# Altium project MCH_MAIN.PrjPcb (part 1 of 3)
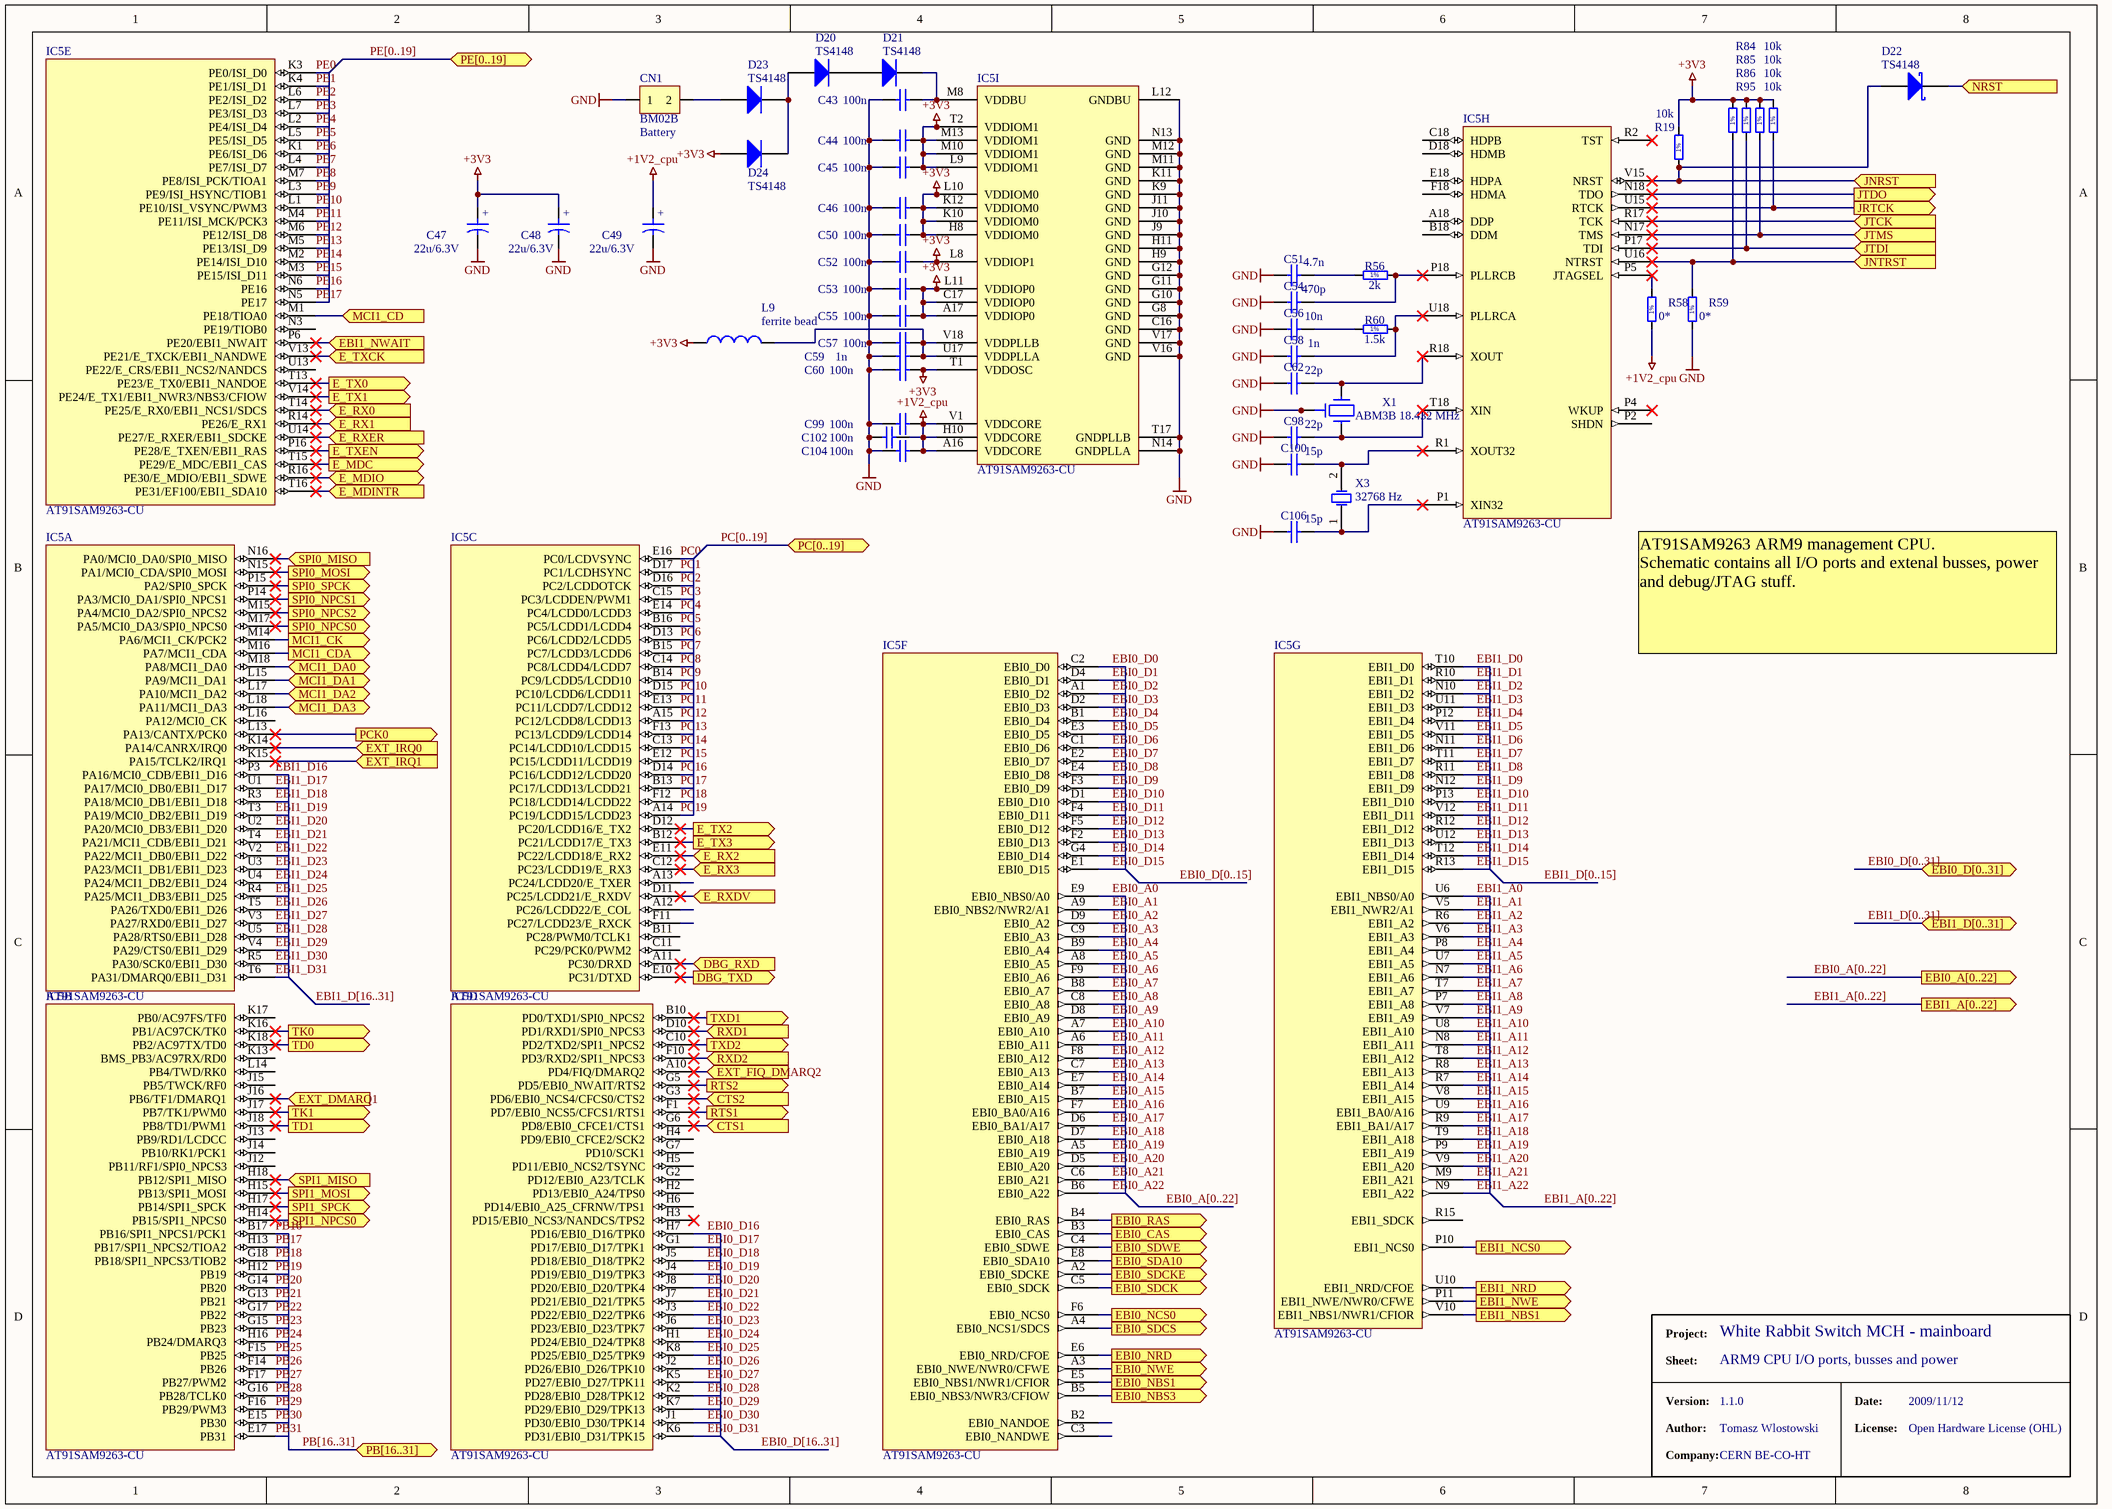
[diagram p0: MB_CPU_io_ports.SchDoc]
5 sheets, 181 parts. Net scope: hierarchical (ports join the sheet entries above them; power ports are global).
Board file: MCH_MAIN.PCBDOC
Sheets:
  MB_CPU_io_ports.SchDoc
  MB_main_FPGA.SchDoc
  MB_ZBT_memory.SchDoc
  MB_fpga_power.SchDoc
  MB_downlink_phy.SchDoc

## Sheet MB_CPU_io_ports.SchDoc
size A3

### Parts
C43  100n  [CAPC1005X55N]
C44  100n  [CAPC1005X55N]
C45  100n  [CAPC1005X55N]
C46  100n  [CAPC1005X55N]
C47  22u/6.3V  [CAPMP3216X180N]
C48  22u/6.3V  [CAPMP3216X180N]
C49  22u/6.3V  [CAPMP3216X180N]
C50  100n  [CAPC1005X55N]
C51  4.7n  [CAPC1005X55N]
C52  100n  [CAPC1005X55N]
C53  100n  [CAPC1005X55N]
C54  470p  [CAPC1005X55N]
C55  100n  [CAPC1005X55N]
C56  10n  [CAPC1005X55N]
C57  100n  [CAPC1005X55N]
C58  1n  [CAPC1005X55N]
C59  1n  [CAPC1005X55N]
C60  100n  [CAPC1005X55N]
C62  22p  [CAPC1005X55N]
C98  22p  [CAPC1005X55N]
C99  100n  [CAPC1005X55N]
C100  15p  [CAPC1005X55N]
C102  100n  [CAPC1005X55N]
C104  100n  [CAPC1005X55N]
C106  15p  [CAPC1005X55N]
CN1  BM02B  Comment2: Battery  [SH_CRIMP_1MM_2]
D20  TS4148  [CD2012-0805]
D21  TS4148  [CD2012-0805]
D22  TS4148  [CD2012-0805]
D23  TS4148  [CD2012-0805]
D24  TS4148  [CD2012-0805]
IC5  AT91SAM9263-CU  [TFBGA324]  (parts A,B,C,D,E,F,G,H,I of 9)
L9  value ferrite bead  [INDC1608-0603]  (hidden comment: fer.bead)
R19  10k  [RESC1005X40N]
R56  2k  [RESC1005X40N]
R58  0*  [RESC1005X40N]
R59  0*  [RESC1005X40N]
R60  1.5k  [RESC1005X40N]
R84  10k  [RESC1005X40N]
R85  10k  [RESC1005X40N]
R86  10k  [RESC1005X40N]
R95  10k  [RESC1005X40N]
X1  ABM3B 18.432 MHz  [XTALL_ABM3]
X3  32768 Hz  [XTAL_32k]

### Ports
CTS1 (in), CTS2 (in), DBG_RXD (in), DBG_TXD (out), E_MDC (out), E_MDINTR (in), E_MDIO (bidir), E_RX0 (in), E_RX1 (in), E_RX2 (in), E_RX3 (in), E_RXDV (in), E_RXER (in), E_TX0 (out), E_TX1 (out), E_TX2 (out), E_TX3 (out), E_TXCK (in), E_TXEN (out), EBI0_A[0..22] (out), EBI0_CAS (out), EBI0_D[0..31] (bidir), EBI0_NBS1 (out), EBI0_NBS3 (out), EBI0_NCS0 (out), EBI0_NRD (out), EBI0_NWE (out), EBI0_RAS (out), EBI0_SDA10 (out), EBI0_SDCK (out), EBI0_SDCKE (out), EBI0_SDCS (out), EBI0_SDWE (out), EBI1_A[0..22] (out), EBI1_D[0..31] (bidir), EBI1_NBS1 (out), EBI1_NCS0 (out), EBI1_NRD (out), EBI1_NWAIT (in), EBI1_NWE (out), EXT_DMARQ1 (in), EXT_FIQ_DMARQ2 (in), EXT_IRQ0 (in), EXT_IRQ1 (in), JNRST (in), JNTRST (in), JRTCK (out), JTCK (in), JTDI (in), JTDO (out), JTMS (in), MCI1_CD (in), MCI1_CDA (out), MCI1_CK (out), MCI1_DA0 (bidir), MCI1_DA1 (bidir), MCI1_DA2 (bidir), MCI1_DA3 (bidir), NRST (in), PB[16..31] (bidir), PC[0..19] (bidir), PCK0 (out), PE[0..19] (bidir), RTS1 (out), RTS2 (out), RXD1 (in), RXD2 (in), SPI0_MISO (in), SPI0_MOSI (out), SPI0_NPCS0 (out), SPI0_NPCS1 (out), SPI0_NPCS2 (out), SPI0_SPCK (out), SPI1_MISO (in), SPI1_MOSI (out), SPI1_NPCS0 (out), SPI1_SPCK (out), TD0 (out), TD1 (out), TK0 (out), TK1 (out), TXD1 (out), TXD2 (out)

### Nets
+1V2_cpu: C49.1 C99.2 C102.2 C104.2 IC5.A16(VDDCORE) IC5.H10(VDDCORE) IC5.V1(VDDCORE) R58.1
+3V3: C44.2 C45.2 C46.2 C47.1 C48.1 C50.2 C52.2 C53.2 C55.2 C60.2 D24.1(A) IC5.A17(VDDIOP0) IC5.C17(VDDIOP0) IC5.H8(VDDIOM0) IC5.K10(VDDIOM0) IC5.K12(VDDIOM0) IC5.L8(VDDIOP1) IC5.L9(VDDIOM1) IC5.L10(VDDIOM0) IC5.L11(VDDIOP0) IC5.M10(VDDIOM1) IC5.M13(VDDIOM1) IC5.T1(VDDOSC) IC5.T2(VDDIOM1) L9.1 R19.2 R84.2 R85.2 R86.2 R95.2
GND: C43.1 C44.1 C45.1 C46.1 C47.2 C48.2 C49.2 C50.1 C51.1 C52.1 C53.1 C54.1 C55.1 C56.1 C57.1 C58.1 C59.1 C60.1 C62.1 C98.1 C99.1 C100.1 C102.1 C104.1 C106.1 CN1.1 IC5.C16(GND) IC5.G8(GND) IC5.G10(GND) IC5.G11(GND) IC5.G12(GND) IC5.H9(GND) IC5.H11(GND) IC5.J9(GND) IC5.J10(GND) IC5.J11(GND) IC5.K9(GND) IC5.K11(GND) IC5.L12(GNDBU) IC5.M11(GND) IC5.M12(GND) IC5.N13(GND) IC5.N14(GNDPLLA) IC5.T17(GNDPLLB) IC5.V16(GND) IC5.V17(GND) R59.1 X1.2 X1.4
EBI0_A0: IC5.E9(EBI0_NBS0/A0)
EBI0_A1: IC5.A9(EBI0_NBS2/NWR2/A1)
EBI0_A2: IC5.D9(EBI0_A2)
EBI0_A3: IC5.C9(EBI0_A3)
EBI0_A4: IC5.B9(EBI0_A4)
EBI0_A5: IC5.A8(EBI0_A5)
EBI0_A6: IC5.F9(EBI0_A6)
EBI0_A7: IC5.B8(EBI0_A7)
EBI0_A8: IC5.C8(EBI0_A8)
EBI0_A9: IC5.D8(EBI0_A9)
EBI0_A10: IC5.A7(EBI0_A10)
EBI0_A11: IC5.A6(EBI0_A11)
EBI0_A12: IC5.F8(EBI0_A12)
EBI0_A13: IC5.C7(EBI0_A13)
EBI0_A14: IC5.E7(EBI0_A14)
EBI0_A15: IC5.B7(EBI0_A15)
EBI0_A16: IC5.F7(EBI0_BA0/A16)
EBI0_A17: IC5.D6(EBI0_BA1/A17)
EBI0_A18: IC5.D7(EBI0_A18)
EBI0_A19: IC5.A5(EBI0_A19)
EBI0_A20: IC5.D5(EBI0_A20)
EBI0_A21: IC5.C6(EBI0_A21)
EBI0_A22: IC5.B6(EBI0_A22)
EBI0_D0: IC5.C2(EBI0_D0)
EBI0_D1: IC5.D4(EBI0_D1)
EBI0_D2: IC5.A1(EBI0_D2)
EBI0_D3: IC5.D2(EBI0_D3)
EBI0_D4: IC5.B1(EBI0_D4)
EBI0_D5: IC5.E3(EBI0_D5)
EBI0_D6: IC5.C1(EBI0_D6)
EBI0_D7: IC5.E2(EBI0_D7)
EBI0_D8: IC5.E4(EBI0_D8)
EBI0_D9: IC5.F3(EBI0_D9)
EBI0_D10: IC5.D1(EBI0_D10)
EBI0_D11: IC5.F4(EBI0_D11)
EBI0_D12: IC5.F5(EBI0_D12)
EBI0_D13: IC5.F2(EBI0_D13)
EBI0_D14: IC5.G4(EBI0_D14)
EBI0_D15: IC5.E1(EBI0_D15)
EBI0_D16: IC5.H7(PD16/EBI0_D16/TPK0)
EBI0_D17: IC5.G1(PD17/EBI0_D17/TPK1)
EBI0_D18: IC5.J5(PD18/EBI0_D18/TPK2)
EBI0_D19: IC5.J4(PD19/EBI0_D19/TPK3)
EBI0_D20: IC5.J8(PD20/EBI0_D20/TPK4)
EBI0_D21: IC5.J7(PD21/EBI0_D21/TPK5)
EBI0_D22: IC5.J3(PD22/EBI0_D22/TPK6)
EBI0_D23: IC5.J6(PD23/EBI0_D23/TPK7)
EBI0_D24: IC5.H1(PD24/EBI0_D24/TPK8)
EBI0_D25: IC5.K8(PD25/EBI0_D25/TPK9)
EBI0_D26: IC5.J2(PD26/EBI0_D26/TPK10)
EBI0_D27: IC5.K5(PD27/EBI0_D27/TPK11)
EBI0_D28: IC5.K2(PD28/EBI0_D28/TPK12)
EBI0_D29: IC5.K7(PD29/EBI0_D29/TPK13)
EBI0_D30: IC5.J1(PD30/EBI0_D30/TPK14)
EBI0_D31: IC5.K6(PD31/EBI0_D31/TPK15)
EBI1_A0: IC5.U6(EBI1_NBS0/A0)
EBI1_A1: IC5.V5(EBI1_NWR2/A1)
EBI1_A2: IC5.R6(EBI1_A2)
EBI1_A3: IC5.V6(EBI1_A3)
EBI1_A4: IC5.P8(EBI1_A4)
EBI1_A5: IC5.U7(EBI1_A5)
EBI1_A6: IC5.N7(EBI1_A6)
EBI1_A7: IC5.T7(EBI1_A7)
EBI1_A8: IC5.P7(EBI1_A8)
EBI1_A9: IC5.V7(EBI1_A9)
EBI1_A10: IC5.U8(EBI1_A10)
EBI1_A11: IC5.N8(EBI1_A11)
EBI1_A12: IC5.T8(EBI1_A12)
EBI1_A13: IC5.R8(EBI1_A13)
EBI1_A14: IC5.R7(EBI1_A14)
EBI1_A15: IC5.V8(EBI1_A15)
EBI1_A16: IC5.U9(EBI1_BA0/A16)
EBI1_A17: IC5.R9(EBI1_BA1/A17)
EBI1_A18: IC5.T9(EBI1_A18)
EBI1_A19: IC5.P9(EBI1_A19)
EBI1_A20: IC5.V9(EBI1_A20)
EBI1_A21: IC5.M9(EBI1_A21)
EBI1_A22: IC5.N9(EBI1_A22)
EBI1_D0: IC5.T10(EBI1_D0)
EBI1_D1: IC5.R10(EBI1_D1)
EBI1_D2: IC5.N10(EBI1_D2)
EBI1_D3: IC5.U11(EBI1_D3)
EBI1_D4: IC5.P12(EBI1_D4)
EBI1_D5: IC5.V11(EBI1_D5)
EBI1_D6: IC5.N11(EBI1_D6)
EBI1_D7: IC5.T11(EBI1_D7)
EBI1_D8: IC5.R11(EBI1_D8)
EBI1_D9: IC5.N12(EBI1_D9)
EBI1_D10: IC5.P13(EBI1_D10)
EBI1_D11: IC5.V12(EBI1_D11)
EBI1_D12: IC5.R12(EBI1_D12)
EBI1_D13: IC5.U12(EBI1_D13)
EBI1_D14: IC5.T12(EBI1_D14)
EBI1_D15: IC5.R13(EBI1_D15)
EBI1_D16: IC5.P3(PA16/MCI0_CDB/EBI1_D16)
EBI1_D17: IC5.U1(PA17/MCI0_DB0/EBI1_D17)
EBI1_D18: IC5.R3(PA18/MCI0_DB1/EBI1_D18)
EBI1_D19: IC5.T3(PA19/MCI0_DB2/EBI1_D19)
EBI1_D20: IC5.U2(PA20/MCI0_DB3/EBI1_D20)
EBI1_D21: IC5.T4(PA21/MCI1_CDB/EBI1_D21)
EBI1_D22: IC5.V2(PA22/MCI1_DB0/EBI1_D22)
EBI1_D23: IC5.U3(PA23/MCI1_DB1/EBI1_D23)
EBI1_D24: IC5.U4(PA24/MCI1_DB2/EBI1_D24)
EBI1_D25: IC5.R4(PA25/MCI1_DB3/EBI1_D25)
EBI1_D26: IC5.T5(PA26/TXD0/EBI1_D26)
EBI1_D27: IC5.V3(PA27/RXD0/EBI1_D27)
EBI1_D28: IC5.U5(PA28/RTS0/EBI1_D28)
EBI1_D29: IC5.V4(PA29/CTS0/EBI1_D29)
EBI1_D30: IC5.R5(PA30/SCK0/EBI1_D30)
EBI1_D31: IC5.T6(PA31/DMARQ0/EBI1_D31)
PB16: IC5.B17(PB16/SPI1_NPCS1/PCK1)
PB17: IC5.H13(PB17/SPI1_NPCS2/TIOA2)
PB18: IC5.G18(PB18/SPI1_NPCS3/TIOB2)
PB19: IC5.H12(PB19)
PB20: IC5.G14(PB20)
PB21: IC5.G13(PB21)
PB22: IC5.G17(PB22)
PB23: IC5.G15(PB23)
PB24: IC5.H16(PB24/DMARQ3)
PB25: IC5.F15(PB25)
PB26: IC5.F14(PB26)
PB27: IC5.F17(PB27/PWM2)
PB28: IC5.G16(PB28/TCLK0)
PB29: IC5.F16(PB29/PWM3)
PB30: IC5.E15(PB30)
PB31: IC5.E17(PB31)
PC0: IC5.E16(PC0/LCDVSYNC)
PC1: IC5.D17(PC1/LCDHSYNC)
PC2: IC5.D16(PC2/LCDDOTCK)
PC3: IC5.C15(PC3/LCDDEN/PWM1)
PC4: IC5.E14(PC4/LCDD0/LCDD3)
PC5: IC5.B16(PC5/LCDD1/LCDD4)
PC6: IC5.D13(PC6/LCDD2/LCDD5)
PC7: IC5.B15(PC7/LCDD3/LCDD6)
PC8: IC5.C14(PC8/LCDD4/LCDD7)
PC9: IC5.B14(PC9/LCDD5/LCDD10)
PC10: IC5.D15(PC10/LCDD6/LCDD11)
PC11: IC5.E13(PC11/LCDD7/LCDD12)
PC12: IC5.A15(PC12/LCDD8/LCDD13)
PC13: IC5.F13(PC13/LCDD9/LCDD14)
PC14: IC5.C13(PC14/LCDD10/LCDD15)
PC15: IC5.E12(PC15/LCDD11/LCDD19)
PC16: IC5.D14(PC16/LCDD12/LCDD20)
PC17: IC5.B13(PC17/LCDD13/LCDD21)
PC18: IC5.F12(PC18/LCDD14/LCDD22)
PC19: IC5.A14(PC19/LCDD15/LCDD23)
PE0: IC5.K3(PE0/ISI_D0)
PE1: IC5.K4(PE1/ISI_D1)
PE2: IC5.L6(PE2/ISI_D2)
PE3: IC5.L7(PE3/ISI_D3)
PE4: IC5.L2(PE4/ISI_D4)
PE5: IC5.L5(PE5/ISI_D5)
PE6: IC5.K1(PE6/ISI_D6)
PE7: IC5.L4(PE7/ISI_D7)
PE8: IC5.M7(PE8/ISI_PCK/TIOA1)
PE9: IC5.L3(PE9/ISI_HSYNC/TIOB1)
PE10: IC5.L1(PE10/ISI_VSYNC/PWM3)
PE11: IC5.M4(PE11/ISI_MCK/PCK3)
PE12: IC5.M6(PE12/ISI_D8)
PE13: IC5.M5(PE13/ISI_D9)
PE14: IC5.M2(PE14/ISI_D10)
PE15: IC5.M3(PE15/ISI_D11)
PE16: IC5.N6(PE16)
PE17: IC5.N5(PE17)
NetC43_2: C43.2 D21.2(K) IC5.M8(VDDBU)
NetC51_2: C51.2 R56.1
NetC54_2: C54.2 IC5.P18(PLLRCB) R56.2
NetC56_2: C56.2 R60.1
NetC57_2: C57.2 C59.2 IC5.U17(VDDPLLA) IC5.V18(VDDPLLB) L9.2
NetC58_2: C58.2 IC5.U18(PLLRCA) R60.2
NetC62_2: C62.2 IC5.R18(XOUT) X1.1
NetC98_2: C98.2 IC5.T18(XIN) X1.3
NetC100_2: C100.2 IC5.R1(XOUT32) X3.2(OSC2)
NetC106_2: C106.2 IC5.P1(XIN32) X3.1(OSC1)
NetCN1_2: CN1.2 D23.1(A)
NetD20_1: D20.1(A) D23.2(K) D24.2(K)
NetD20_2: D20.2(K) D21.1(A)
NetD22_1: D22.1(A) IC5.V15(NRST) R19.1 ; port JNRST
NetD22_2: D22.2(K) ; port NRST
NetIC5_A2: IC5.A2(EBI0_SDCKE) ; port EBI0_SDCKE
NetIC5_A3: IC5.A3(EBI0_NWE/NWR0/CFWE) ; port EBI0_NWE
NetIC5_A4: IC5.A4(EBI0_NCS1/SDCS) ; port EBI0_SDCS
NetIC5_A10: IC5.A10(PD4/FIQ/DMARQ2) ; port EXT_FIQ_DMARQ2
NetIC5_A11: IC5.A11(PC30/DRXD) ; port DBG_RXD
NetIC5_B3: IC5.B3(EBI0_CAS) ; port EBI0_CAS
NetIC5_B4: IC5.B4(EBI0_RAS) ; port EBI0_RAS
NetIC5_B5: IC5.B5(EBI0_NBS3/NWR3/CFIOW) ; port EBI0_NBS3
NetIC5_B10: IC5.B10(PD0/TXD1/SPI0_NPCS2) ; port TXD1
NetIC5_B12: IC5.B12(PC21/LCDD17/E_TX3) ; port E_TX3
NetIC5_C4: IC5.C4(EBI0_SDWE) ; port EBI0_SDWE
NetIC5_C5: IC5.C5(EBI0_SDCK) ; port EBI0_SDCK
NetIC5_C10: IC5.C10(PD2/TXD2/SPI1_NPCS2) ; port TXD2
NetIC5_C12: IC5.C12(PC23/LCDD19/E_RX3) ; port E_RX3
NetIC5_D10: IC5.D10(PD1/RXD1/SPI0_NPCS3) ; port RXD1
NetIC5_D11: IC5.D11(PC25/LCDD21/E_RXDV) ; port E_RXDV
NetIC5_D12: IC5.D12(PC20/LCDD16/E_TX2) ; port E_TX2
NetIC5_E5: IC5.E5(EBI0_NBS1/NWR1/CFIOR) ; port EBI0_NBS1
NetIC5_E6: IC5.E6(EBI0_NRD/CFOE) ; port EBI0_NRD
NetIC5_E8: IC5.E8(EBI0_SDA10) ; port EBI0_SDA10
NetIC5_E10: IC5.E10(PC31/DTXD) ; port DBG_TXD
NetIC5_E11: IC5.E11(PC22/LCDD18/E_RX2) ; port E_RX2
NetIC5_F1: IC5.F1(PD7/EBI0_NCS5/CFCS1/RTS1) ; port RTS1
NetIC5_F6: IC5.F6(EBI0_NCS0) ; port EBI0_NCS0
NetIC5_F10: IC5.F10(PD3/RXD2/SPI1_NPCS3) ; port RXD2
NetIC5_G3: IC5.G3(PD6/EBI0_NCS4/CFCS0/CTS2) ; port CTS2
NetIC5_G5: IC5.G5(PD5/EBI0_NWAIT/RTS2) ; port RTS2
NetIC5_G6: IC5.G6(PD8/EBI0_CFCE1/CTS1) ; port CTS1
NetIC5_H14: IC5.H14(PB15/SPI1_NPCS0) ; port SPI1_NPCS0
NetIC5_H15: IC5.H15(PB13/SPI1_MOSI) ; port SPI1_MOSI
NetIC5_H17: IC5.H17(PB14/SPI1_SPCK) ; port SPI1_SPCK
NetIC5_H18: IC5.H18(PB12/SPI1_MISO) ; port SPI1_MISO
NetIC5_J16: IC5.J16(PB6/TF1/DMARQ1) ; port EXT_DMARQ1
NetIC5_J17: IC5.J17(PB7/TK1/PWM0) ; port TK1
NetIC5_J18: IC5.J18(PB8/TD1/PWM1) ; port TD1
NetIC5_K14: IC5.K14(PA14/CANRX/IRQ0) ; port EXT_IRQ0
NetIC5_K15: IC5.K15(PA15/TCLK2/IRQ1) ; port EXT_IRQ1
NetIC5_K16: IC5.K16(PB1/AC97CK/TK0) ; port TK0
NetIC5_K18: IC5.K18(PB2/AC97TX/TD0) ; port TD0
NetIC5_L13: IC5.L13(PA13/CANTX/PCK0) ; port PCK0
NetIC5_L15: IC5.L15(PA9/MCI1_DA1) ; port MCI1_DA1
NetIC5_L17: IC5.L17(PA10/MCI1_DA2) ; port MCI1_DA2
NetIC5_L18: IC5.L18(PA11/MCI1_DA3) ; port MCI1_DA3
NetIC5_M1: IC5.M1(PE18/TIOA0) ; port MCI1_CD
NetIC5_M14: IC5.M14(PA6/MCI1_CK/PCK2) ; port MCI1_CK
NetIC5_M15: IC5.M15(PA4/MCI0_DA2/SPI0_NPCS2) ; port SPI0_NPCS2
NetIC5_M16: IC5.M16(PA7/MCI1_CDA) ; port MCI1_CDA
NetIC5_M17: IC5.M17(PA5/MCI0_DA3/SPI0_NPCS0) ; port SPI0_NPCS0
NetIC5_M18: IC5.M18(PA8/MCI1_DA0) ; port MCI1_DA0
NetIC5_N15: IC5.N15(PA1/MCI0_CDA/SPI0_MOSI) ; port SPI0_MOSI
NetIC5_N16: IC5.N16(PA0/MCI0_DA0/SPI0_MISO) ; port SPI0_MISO
NetIC5_N17: IC5.N17(TMS) R86.1 ; port JTMS
NetIC5_N18: IC5.N18(TDO) ; port JTDO
NetIC5_P5: IC5.P5(JTAGSEL) R58.2
NetIC5_P6: IC5.P6(PE20/EBI1_NWAIT) ; port EBI1_NWAIT
NetIC5_P10: IC5.P10(EBI1_NCS0) ; port EBI1_NCS0
NetIC5_P11: IC5.P11(EBI1_NWE/NWR0/CFWE) ; port EBI1_NWE
NetIC5_P14: IC5.P14(PA3/MCI0_DA1/SPI0_NPCS1) ; port SPI0_NPCS1
NetIC5_P15: IC5.P15(PA2/SPI0_SPCK) ; port SPI0_SPCK
NetIC5_P16: IC5.P16(PE28/E_TXEN/EBI1_RAS) ; port E_TXEN
NetIC5_P17: IC5.P17(TDI) R85.1 ; port JTDI
NetIC5_R14: IC5.R14(PE26/E_RX1) ; port E_RX1
NetIC5_R16: IC5.R16(PE30/E_MDIO/EBI1_SDWE) ; port E_MDIO
NetIC5_R17: IC5.R17(TCK) ; port JTCK
NetIC5_T13: IC5.T13(PE23/E_TX0/EBI1_NANDOE) ; port E_TX0
NetIC5_T14: IC5.T14(PE25/E_RX0/EBI1_NCS1/SDCS) ; port E_RX0
NetIC5_T15: IC5.T15(PE29/E_MDC/EBI1_CAS) ; port E_MDC
NetIC5_T16: IC5.T16(PE31/EF100/EBI1_SDA10) ; port E_MDINTR
NetIC5_U10: IC5.U10(EBI1_NRD/CFOE) ; port EBI1_NRD
NetIC5_U14: IC5.U14(PE27/E_RXER/EBI1_SDCKE) ; port E_RXER
NetIC5_U15: IC5.U15(RTCK) R95.1 ; port JRTCK
NetIC5_U16: IC5.U16(NTRST) R59.2 R84.1 ; port JNTRST
NetIC5_V10: IC5.V10(EBI1_NBS1/NWR1/CFIOR) ; port EBI1_NBS1
NetIC5_V13: IC5.V13(PE21/E_TXCK/EBI1_NANDWE) ; port E_TXCK
NetIC5_V14: IC5.V14(PE24/E_TX1/EBI1_NWR3/NBS3/CFIOW) ; port E_TX1

Not connected (* = marked no-connect by the designer): IC5 A12(PC26/LCDD22/E_COL) A13(PC24/LCDD20/E_TXER) A18(DDP) B2(EBI0_NANDOE) B11(PC28/PWM0/TCLK1) B18(DDM) C3(EBI0_NANDWE) C11(PC29/PCK0/PWM2) C18(HDPB) D18(HDMB) E18(HDPA) F11(PC27/LCDD23/E_RXCK) F18(HDMA) G2(PD12/EBI0_A23/TCLK) G7(PD10/SCK1) H2(PD13/EBI0_A24/TPS0) H3(PD15/EBI0_NCS3/NANDCS/TPS2)* H4(PD9/EBI0_CFCE2/SCK2) H5(PD11/EBI0_NCS2/TSYNC) H6(PD14/EBI0_A25_CFRNW/TPS1) J12(PB11/RF1/SPI0_NPCS3) J13(PB9/RD1/LCDCC) J14(PB10/RK1/PCK1) J15(PB5/TWCK/RF0) K13(BMS_PB3/AC97RX/RD0) K17(PB0/AC97FS/TF0) L14(PB4/TWD/RK0) L16(PA12/MCI0_CK) N3(PE19/TIOB0) P2(SHDN) P4(WKUP)* R2(TST)* R15(EBI1_SDCK) U13(PE22/E_CRS/EBI1_NCS2/NANDCS)

### Buses and harness runs
bus EBI0_A[0..22]
bus EBI0_A[0..22] = port EBI0_A[0..22]
bus EBI0_D[0..15]
bus EBI0_D[0..31] = port EBI0_D[0..31]
bus EBI0_D[16..31]
bus EBI1_A[0..22]
bus EBI1_A[0..22] = port EBI1_A[0..22]
bus EBI1_D[0..15]
bus EBI1_D[0..31] = port EBI1_D[0..31]
bus EBI1_D[16..31]
bus PB[16..31] = port PB[16..31]
bus PC[0..19] = port PC[0..19]
bus PE[0..19] = port PE[0..19]

### Notes on the sheet
- !
- (near IC5) AT91SAM9263 ARM9 management CPU.
  Schematic contains all I/O ports and extenal busses, power and debug/JTAG stuff.
- Project:
- Sheet:
- ARM9 CPU I/O ports, busses and power
- White Rabbit Switch MCH - mainboard
- Version:
- Author:
- Company:
- 1.1.0
- Tomasz Wlostowski
- CERN BE-CO-HT
- Date:
- License:
- 2009/11/12
- Open Hardware License (OHL)
- (in symbol CTE3216-18_22UF_10V_10%) +
- (in symbol R0402_0R_JUMPER) 1%
- (in symbol R0402_1K5_1%_0.0625W_100PPM) 1%
- (in symbol R0402_2K_1%_0.0625W_100PPM) 1%
- (in symbol R0402_10K_1%_0.0625W_100PPM) 1%

### Library data of the parts
C43-C46 C50 C52 C53 C55 C57 C60 C99 C102 C104 = CC0402_100NF_16V_10%_X7R: Non-polarised capacitor; Part Description: SMD Multilayer Chip Ceramic Capacitor; Manufacturer: GENERIC; Manufacturer1 Part Number: 223878715649; Manufacturer1 Datasheet: \\cern.ch\dfs\Applications\Altium\Datasheets\CC0402_X7R_PHYCOMP.pdf; Value: 100nF; Voltage: 16V; TC: X7R; Tolerance: ±10%; Table: Capacitors SMD; Part Number: CC0402_100NF_16V_10%_X7R; Component Kind: Standard; Component Type: Standard; Designator: Capacitor - non polarized; Library Reference: Capacitor - non polarized; Pin Count: 2; Status: Not Recommended; Manufacturer Part Number: CC0402_100NF_16V_10%_X7R; Case: 0402; Mounted: Yes; Socket: No; SMD: Yes; Manufacturer1 Example: PHYCOMP; Manufacturer1 ComponentHeight: 0.55mm; HelpURL: \\cern.ch\dfs\Applications\Altium\Datasheets\CC0402_X7R_PHYCOMP.pdf; Author: CERN DEM JLC; CreateDate: 12/3/2007; LatestRevisionDate: 12/3/2007
C47-C49 = CTE3216-18_22UF_10V_10%: Polarised capacitor; Part Description: Solid Tantalum Chip Capacitor; Manufacturer: GENERIC; Manufacturer1 Part Number: TAJA226K010R; Manufacturer1 Datasheet: \\cern.ch\dfs\Applications\Altium\Datasheets\CTE_AVX_TAJ.pdf; Value: 22uF; Voltage: 10V; Tolerance: ±10%; Table: Capacitors SMD; Part Number: CTE3216-18_22UF_10V_10%; Component Kind: Standard; Component Type: Standard; Designator: Capacitor - polarized; Library Reference: Capacitor - polarized; Pin Count: 2; Status: Preferred; Manufacturer Part Number: CTE3216-18_22UF_10V_10%; Case: A; Mounted: Yes; Socket: No; SMD: Yes; Manufacturer1 Example: AVX; Manufacturer1 ComponentHeight: 1.8mm; HelpURL: \\cern.ch\dfs\Applications\Altium\Datasheets\CTE_AVX_TAJ.pdf; Author: CERN DEM JLC; CreateDate: 12/3/2007; LatestRevisionDate: 12/3/2007
C51 = CC0402_4.7NF_16V_10%_X7R: Non-polarised capacitor; Part Description: SMD Multilayer Chip Ceramic Capacitor; Manufacturer: GENERIC; Manufacturer1 Part Number: 223878715632; Manufacturer1 Datasheet: \\cern.ch\dfs\Applications\Altium\Datasheets\CC0402_X7R_PHYCOMP.pdf; Value: 4.7nF; Voltage: 16V; TC: X7R; Tolerance: ±10%; Table: Capacitors SMD; Part Number: CC0402_4.7NF_16V_10%_X7R; Component Kind: Standard; Component Type: Standard; Designator: Capacitor - non polarized; Library Reference: Capacitor - non polarized; Pin Count: 2; Status: Not Recommended; Manufacturer Part Number: CC0402_4.7NF_16V_10%_X7R; Case: 0402; Mounted: Yes; Socket: No; SMD: Yes; Manufacturer1 Example: PHYCOMP; Manufacturer1 ComponentHeight: 0.55mm; HelpURL: \\cern.ch\dfs\Applications\Altium\Datasheets\CC0402_X7R_PHYCOMP.pdf; Author: CERN DEM JLC; CreateDate: 2007-12-03; LatestRevisionDate: 2007-12-03
C54 = CC0402_470PF_50V_10%_X7R: Non-polarised capacitor; Part Description: SMD Multilayer Chip Ceramic Capacitor; Manufacturer: GENERIC; Manufacturer1 Part Number: 223858715618; Manufacturer1 Datasheet: \\cern.ch\dfs\Applications\Altium\Datasheets\CC0402_NP0_PHYCOMP.pdf; Value: 470pF; Voltage: 50V; TC: X7R; Tolerance: ±10%; Table: Capacitors SMD; Part Number: CC0402_470PF_50V_10%_X7R; Component Kind: Standard; Component Type: Standard; Designator: Capacitor - non polarized; Library Reference: Capacitor - non polarized; Pin Count: 2; Status: Not Recommended; Manufacturer Part Number: CC0402_470PF_50V_10%_X7R; Case: 0402; Mounted: Yes; Socket: No; SMD: Yes; Manufacturer1 Example: PHYCOMP; Manufacturer1 ComponentHeight: 0.55mm; HelpURL: \\cern.ch\dfs\Applications\Altium\Datasheets\CC0402_NP0_PHYCOMP.pdf; Author: CERN DEM JLC; CreateDate: 2007-12-03; LatestRevisionDate: 2007-12-03
C56 = CC0402_10NF_16V_10%_X7R: Non-polarised capacitor; Part Description: SMD Multilayer Chip Ceramic Capacitor; Manufacturer: GENERIC; Manufacturer1 Part Number: 223878715636; Manufacturer1 Datasheet: \\cern.ch\dfs\Applications\Altium\Datasheets\CC0402_X7R_PHYCOMP.pdf; Value: 10nF; Voltage: 16V; TC: X7R; Tolerance: ±10%; Table: Capacitors SMD; Part Number: CC0402_10NF_16V_10%_X7R; Component Kind: Standard; Component Type: Standard; Designator: Capacitor - non polarized; Library Reference: Capacitor - non polarized; Pin Count: 2; Status: Not Recommended; Manufacturer Part Number: CC0402_10NF_16V_10%_X7R; Case: 0402; Mounted: Yes; Socket: No; SMD: Yes; Manufacturer1 Example: PHYCOMP; Manufacturer1 ComponentHeight: 0.55mm; HelpURL: \\cern.ch\dfs\Applications\Altium\Datasheets\CC0402_X7R_PHYCOMP.pdf; Author: CERN DEM JLC; CreateDate: 2007-12-03; LatestRevisionDate: 2007-12-03
C58 = CC0402_1NF_50V_10%_X7R: Non-polarised capacitor; Part Description: SMD Multilayer Chip Ceramic Capacitor; Manufacturer: GENERIC; Manufacturer1 Part Number: 223858715623; Manufacturer1 Datasheet: \\cern.ch\dfs\Applications\Altium\Datasheets\CC0402_X7R_PHYCOMP.pdf; Value: 1nF; Voltage: 50V; TC: X7R; Tolerance: ±10%; Table: Capacitors SMD; Part Number: CC0402_1NF_50V_10%_X7R; Component Kind: Standard; Component Type: Standard; Designator: Capacitor - non polarized; Library Reference: Capacitor - non polarized; Pin Count: 2; Status: Not Recommended; Manufacturer Part Number: CC0402_1NF_50V_10%_X7R; Case: 0402; Mounted: Yes; Socket: No; SMD: Yes; Manufacturer1 Example: PHYCOMP; Manufacturer1 ComponentHeight: 0.55mm; HelpURL: \\cern.ch\dfs\Applications\Altium\Datasheets\CC0402_X7R_PHYCOMP.pdf; Author: CERN DEM JLC; CreateDate: 2007-12-03; LatestRevisionDate: 2007-12-03
C59 = CC0402_1.0NF_50V_10%_X7R: Non-polarised capacitor; Part Description: SMD Multilayer Chip Ceramic Capacitor; Manufacturer: GENERIC; Manufacturer1 Part Number: 223858715623; Manufacturer1 Datasheet: \\cern.ch\dfs\Applications\Altium\Datasheets\CC0402_X7R_PHYCOMP.pdf; Value: 1nF; Voltage: 50V; TC: X7R; Tolerance: ±10%; Table: Capacitors SMD; Part Number: CC0402_1.0NF_50V_10%_X7R; Component Kind: Standard; Component Type: Standard; Designator: Capacitor - non polarized; Library Reference: Capacitor - non polarized; Pin Count: 2; Status: Not Recommended; Manufacturer Part Number: CC0402_1.0NF_50V_10%_X7R; Case: 0402; Mounted: Yes; Socket: No; SMD: Yes; Manufacturer1 Example: PHYCOMP; Manufacturer1 ComponentHeight: 0.55mm; HelpURL: \\cern.ch\dfs\Applications\Altium\Datasheets\CC0402_X7R_PHYCOMP.pdf; Author: CERN DEM JLC; CreateDate: 12/3/2007; LatestRevisionDate: 12/3/2007
C62 C98 = CC0402_22PF_50V_5%_NP0: Non-polarised capacitor; Part Description: SMD Multilayer Chip Ceramic Capacitor; Manufacturer: GENERIC; Manufacturer1 Part Number: 223886915229; Manufacturer1 Datasheet: \\cern.ch\dfs\Applications\Altium\Datasheets\CC0402_NP0_PHYCOMP.pdf; Value: 22pF; Voltage: 50V; TC: NP0; Tolerance: ±5%; Table: Capacitors SMD; Part Number: CC0402_22PF_50V_5%_NP0; Component Kind: Standard; Component Type: Standard; Designator: Capacitor - non polarized; Library Reference: Capacitor - non polarized; Pin Count: 2; Status: Not Recommended; Manufacturer Part Number: CC0402_22PF_50V_5%_NP0; Case: 0402; Mounted: Yes; Socket: No; SMD: Yes; Manufacturer1 Example: PHYCOMP; Manufacturer1 ComponentHeight: 0.55mm; HelpURL: \\cern.ch\dfs\Applications\Altium\Datasheets\CC0402_NP0_PHYCOMP.pdf; Author: CERN DEM JLC; CreateDate: 2007-12-03; LatestRevisionDate: 2007-12-03
C100 C106 = CC0402_15PF_50V_5%_NP0: Non-polarised capacitor; Part Description: SMD Multilayer Chip Ceramic Capacitor; Manufacturer: GENERIC; Manufacturer1 Part Number: 223886915159; Manufacturer1 Datasheet: \\cern.ch\dfs\Applications\Altium\Datasheets\CC0402_NP0_PHYCOMP.pdf; Value: 15pF; Voltage: 50V; TC: NP0; Tolerance: ±5%; Table: Capacitors SMD; Part Number: CC0402_15PF_50V_5%_NP0; Component Kind: Standard; Component Type: Standard; Designator: Capacitor - non polarized; Library Reference: Capacitor - non polarized; Pin Count: 2; Status: Not Recommended; Manufacturer Part Number: CC0402_15PF_50V_5%_NP0; Case: 0402; Mounted: Yes; Socket: No; SMD: Yes; Manufacturer1 Example: PHYCOMP; Manufacturer1 ComponentHeight: 0.55mm; HelpURL: \\cern.ch\dfs\Applications\Altium\Datasheets\CC0402_NP0_PHYCOMP.pdf; Author: CERN DEM JLC; CreateDate: 2007-12-03; LatestRevisionDate: 2007-12-03
CN1 = CON_SH_CRIMP_1MM_2: RefId: Far/1679127
D20 D21 D23 D24 = Diode: Default Diode; Published: 8-Jun-2000; LatestRevisionDate: 17-Jul-2002; LatestRevisionNote: Re-released for DXP Platform.; PackageDocument: Sep-1996; PackageReference: SMC; Publisher: Altium Limited; Code_JEDEC: DO-214-AB
D22 = D Schottky: Schottky Diode; Published: 8-Jun-2000; LatestRevisionDate: 17-Jul-2002; LatestRevisionNote: Re-released for DXP Platform.; PackageReference: SMB; Publisher: Altium Limited; Code_JEDEC: DO-214-AA
IC5 = AT91SAM9263: Atmel ARM926 MCU; Supplier: EBV; RefId: AT91SAM9263-CU; Value: AT91SAM9263-CU
L9 = Inductor: Ferrite bead; Published: 8-Jun-2000; Revision: July-2002: Re-released for DXP Platform.; Publisher: Altium Limited
R19 R84-R86 R95 = R0402_10K_1%_0.0625W_100PPM: Resistor - 1%; Part Description: General Purpose Thick Film Chip Resistor; Manufacturer: GENERIC; Manufacturer1 Part Number: 232270671003; Manufacturer1 Datasheet: \\cern.ch\dfs\Applications\Altium\Datasheets\R0402_Phycomp_RC0402.pdf; TC: ±100ppm/°C; Table: Resistors SMD; Part Number: R0402_10K_1%_0.0625W_100PPM; Component Kind: Standard; Component Type: Standard; Designator: Resistor - 1%; Library Reference: Resistor - 1%; Pin Count: 2; Value: 10k; Status: Not recommended; Power: 0.0625W; Tolerance: ±1%; Manufacturer Part Number: R0402_10K_1%_0.0625W_100PPM; Case: 0402; Mounted: Yes; Socket: No; SMD: Yes; Manufacturer1 Example: PHYCOMP; Manufacturer1 ComponentHeight: 0.4mm; HelpURL: \\cern.ch\dfs\Applications\Altium\Datasheets\R0402_Phycomp_RC0402.pdf; Author: CERN DEM JLC; CreateDate: 2007-12-03; LatestRevisionDate: 2008-03-13
R56 = R0402_2K_1%_0.0625W_100PPM: Resistor - 1%; Part Description: General Purpose Thick Film Chip Resistor; Manufacturer: GENERIC; Manufacturer1 Part Number: 232270672002; Manufacturer1 Datasheet: \\cern.ch\dfs\Applications\Altium\Datasheets\R0402_Phycomp_RC0402.pdf; TC: ±100ppm/°C; Table: Resistors SMD; Part Number: R0402_2K_1%_0.0625W_100PPM; Component Kind: Standard; Component Type: Standard; Designator: Resistor - 1%; Library Reference: Resistor - 1%; Pin Count: 2; Value: 2k; Status: Not recommended; Power: 0.0625W; Tolerance: ±1%; Manufacturer Part Number: R0402_2K_1%_0.0625W_100PPM; Case: 0402; Mounted: Yes; Socket: No; SMD: Yes; Manufacturer1 Example: PHYCOMP; Manufacturer1 ComponentHeight: 0.4mm; HelpURL: \\cern.ch\dfs\Applications\Altium\Datasheets\R0402_Phycomp_RC0402.pdf; Author: CERN DEM JLC; CreateDate: 2007-12-03; LatestRevisionDate: 2008-03-13
R58 R59 = R0402_0R_JUMPER: Resistor - 1%; Part Description: 1A (0.05R Max DC Resistance) Zero Ohm Jumper; Manufacturer: GENERIC; Manufacturer1 Part Number: 232270591001; Manufacturer1 Datasheet: \\cern.ch\dfs\Applications\Altium\Datasheets\R0402_Phycomp_RC0402.pdf; Value: 0; Table: Resistors SMD; Part Number: R0402_0R_JUMPER; Component Kind: Standard; Component Type: Standard; Designator: Resistor - 1%; Library Reference: Resistor - 1%; Pin Count: 2; Status: Not recommended; Manufacturer Part Number: R0402_0R_JUMPER; Case: 0402; Mounted: Yes; Socket: No; SMD: Yes; Manufacturer1 Example: PHYCOMP; Manufacturer1 ComponentHeight: 0.4mm; HelpURL: \\cern.ch\dfs\Applications\Altium\Datasheets\R0402_Phycomp_RC0402.pdf; Author: CERN DEM JLC; CreateDate: 2007-12-03; LatestRevisionDate: 2008-03-13
R60 = R0402_1K5_1%_0.0625W_100PPM: Resistor - 1%; Part Description: General Purpose Thick Film Chip Resistor; Manufacturer: GENERIC; Manufacturer1 Part Number: 232270671502; Manufacturer1 Datasheet: \\cern.ch\dfs\Applications\Altium\Datasheets\R0402_Phycomp_RC0402.pdf; Value: 1k5; TC: ±100ppm/°C; Table: Resistors SMD; Part Number: R0402_1K5_1%_0.0625W_100PPM; Component Kind: Standard; Component Type: Standard; Designator: Resistor - 1%; Library Reference: Resistor - 1%; Pin Count: 2; Status: Not recommended; Power: 0.0625W; Tolerance: ±1%; Manufacturer Part Number: R0402_1K5_1%_0.0625W_100PPM; Case: 0402; Mounted: Yes; Socket: No; SMD: Yes; Manufacturer1 Example: PHYCOMP; Manufacturer1 ComponentHeight: 0.4mm; HelpURL: \\cern.ch\dfs\Applications\Altium\Datasheets\R0402_Phycomp_RC0402.pdf; Author: CERN DEM JLC; CreateDate: 2007-12-03; LatestRevisionDate: 2008-03-13
X1 = X_CRYSTAL_SMD_ABM8: Miniature crystal oscillator (ABRACON); Value: ABM3B-18.432MHZ-B2-T; RefId: 1611814; Supplier: Farnell
X3 = XTAL: Crystal Oscillator; RefId: Far/1652573; Published: 8-Jun-2000; LatestRevisionDate: 17-Jul-2002; LatestRevisionNote: Re-released for DXP Platform.; PackageReference: R38; Publisher: Altium Limited